# EAGLE schematic BrillBox (EAGLE 9.4.2)
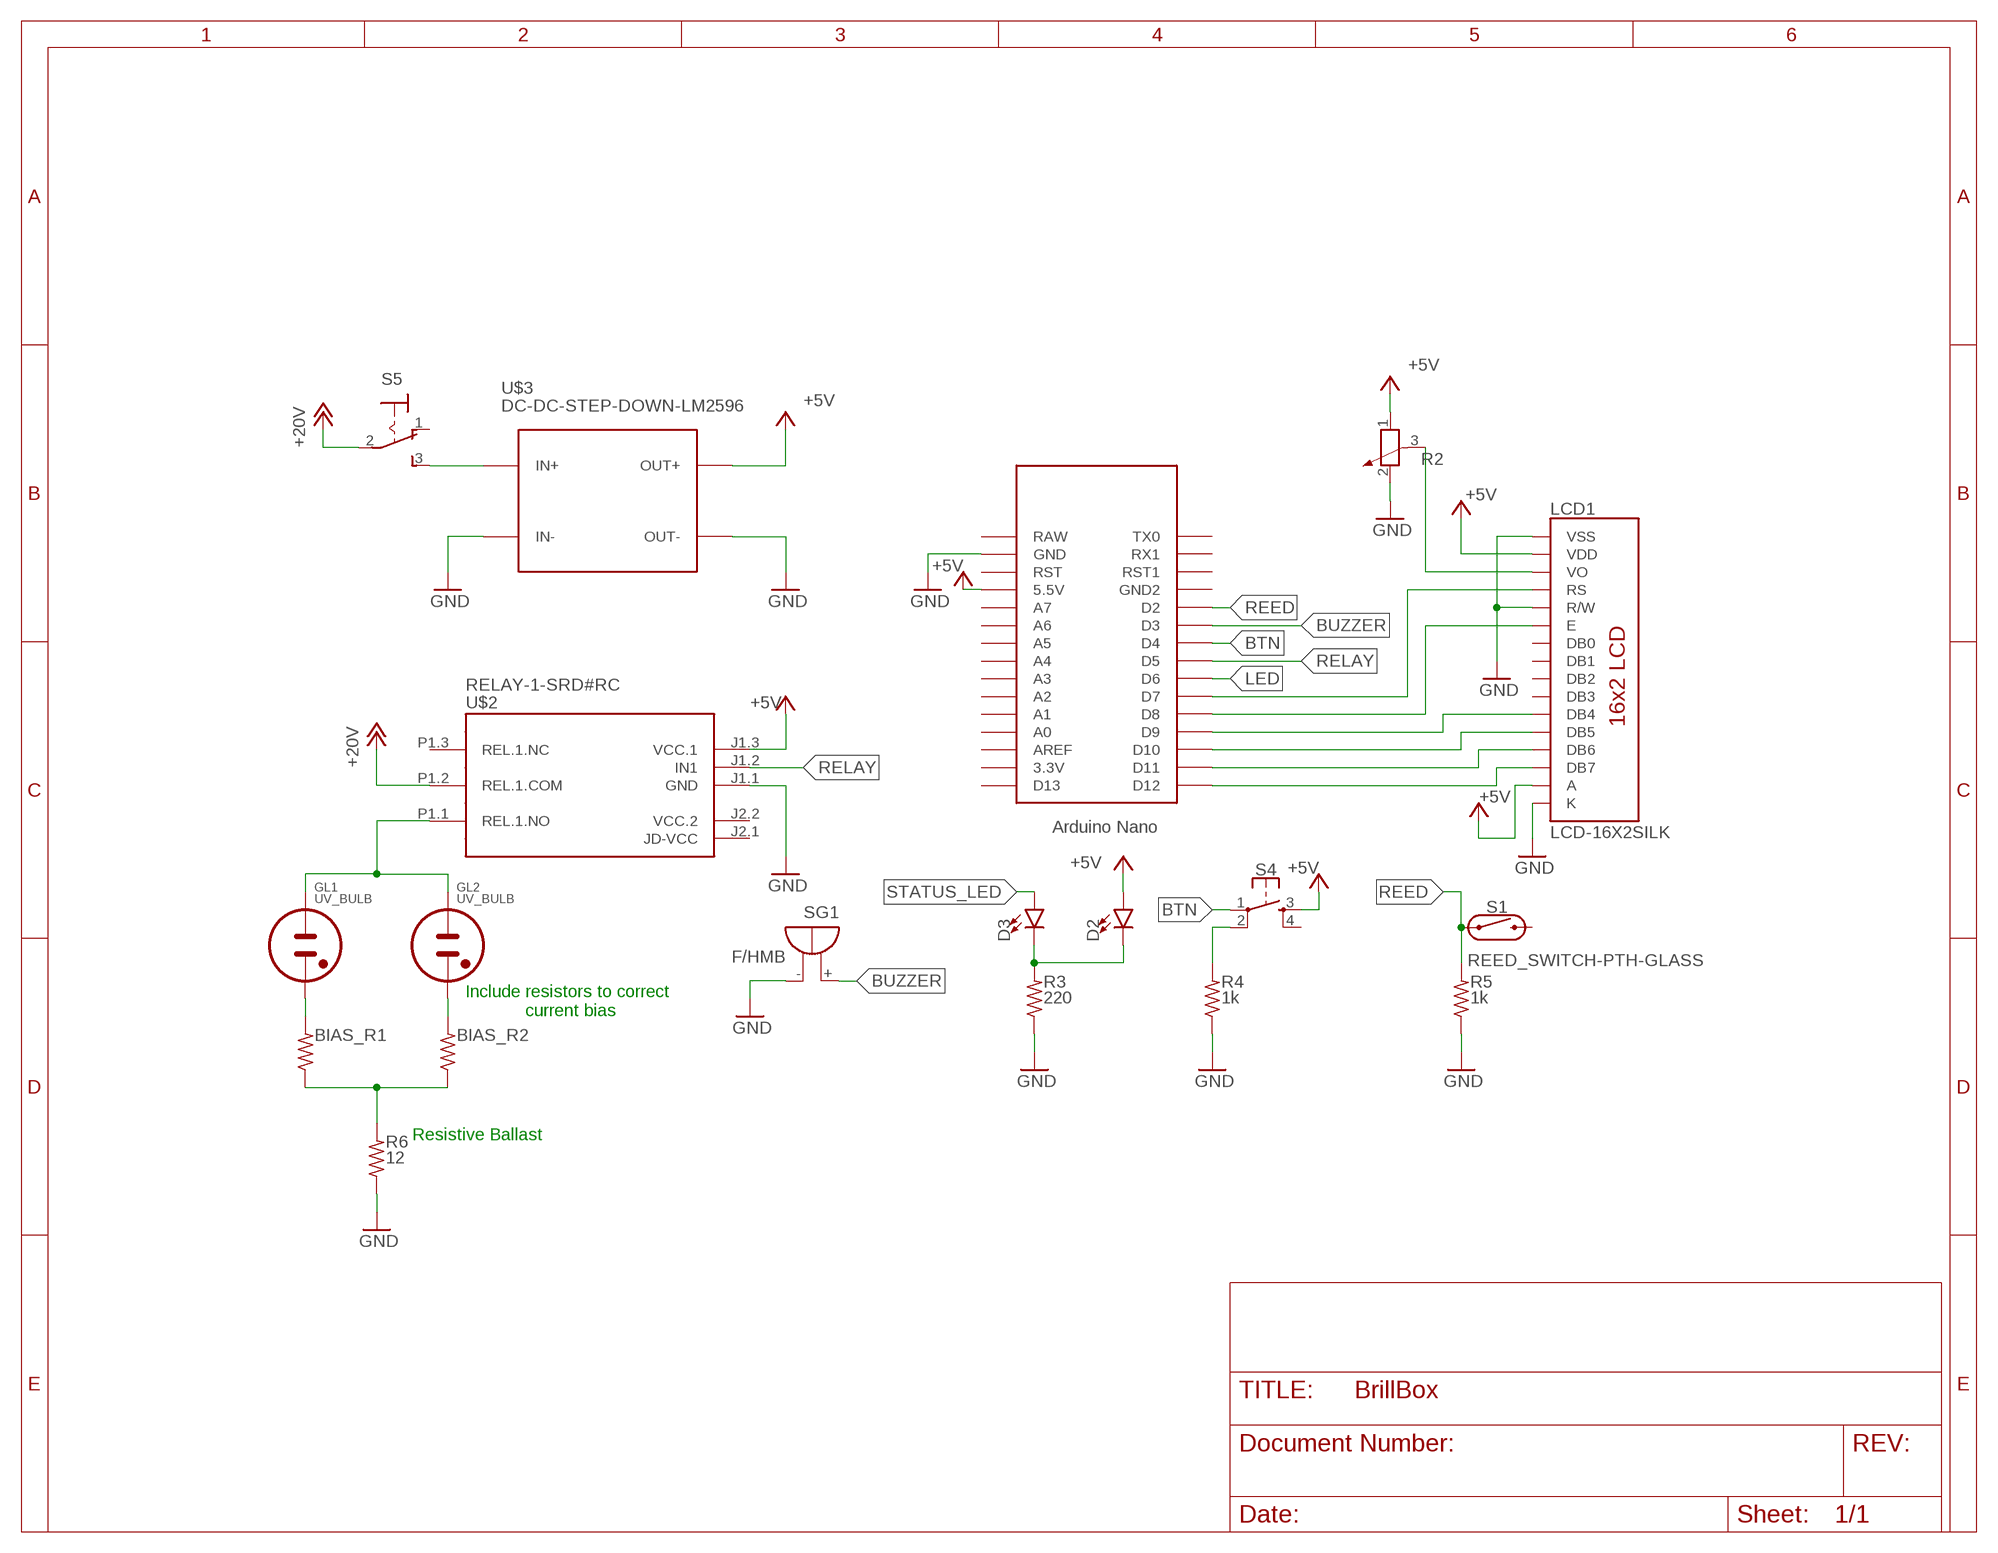
[diagram p0: schematic, sheet 1]

## Parts
BIAS_R1  R-US_0207/12  [0207/12]
BIAS_R2  R-US_0207/12  [0207/12]
D2  LED5MM  [LED_5MM]
D3  LED5MM  [LED_5MM]
GL1  UV_BULB  NE2-NEON-BULB-SMD  [NE2-NEON-BULB-SMD]
GL2  UV_BULB  NE2-NEON-BULB-SMD  [NE2-NEON-BULB-SMD]
LCD1  LCD-16X2SILK  [LCD-16X2]
R2  POTENTIOMETER_PT-10S  [PT-10S]
R3  220  R-US_0207/12  [0207/12]
R4  1k  R-US_0207/12  [0207/12]
R5  1k  R-US_0207/12  [0207/12]
R6  12  R-US_0207/12  [0207/12]
S1  REED_SWITCH-PTH-GLASS  [REED_SWITCH_GLASS]
S4  MOMENTARY-SWITCH-SPST-2-SMD-4.6X2.8MM  [TACTILE_SWITCH_SMD_4.6X2.8MM]
S5  M9040P  [M9040P]
SG1  F/HMB  [F/HMB]
U$1  NANO  [NANO]
U$2  RELAY-1-SRD#RC  [RELAY-1-SRD#RC]
U$3  DC-DC-STEP-DOWN-LM2596  [DC-DC-STEP-DOWN-LM2596]

## Nets
+5V: D2.A LCD1.2(VDD) LCD1.15(A) R2.1 S4.3 U$1.5V(5.5V) U$2.J1.3(VCC.1) U$3.OUT+
+12V: S5.2(P) U$2.P1.2(REL.1.COM) ; supply symbol labelled +20V
BTN: S4.1 U$1.D4
BUZZER: SG1.+ U$1.D3
GND: LCD1.1(VSS) LCD1.5(R/W) LCD1.16(K) R2.2 R3.1 R4.1 R5.1 R6.1 SG1.- U$1.GND U$2.J1.1(GND) U$3.IN- U$3.OUT-
LED: U$1.D6
N$1: LCD1.14(DB7) U$1.D12
N$2: LCD1.13(DB6) U$1.D11
N$3: LCD1.12(DB5) U$1.D10
N$4: LCD1.11(DB4) U$1.D9
N$5: LCD1.6(E) U$1.D8
N$6: LCD1.4(RS) U$1.D7
N$7: GL1.1(A) GL2.1(A) U$2.P1.1(REL.1.NO)
N$8: D2.K(C) D3.K(C) R3.2
N$9: S5.3(S) U$3.IN+
N$10: BIAS_R2.2 GL2.2(A1)
N$11: R4.2 S4.2
N$12: BIAS_R1.2 GL1.2(A1)
N$13: BIAS_R1.1 BIAS_R2.1 R6.2
N$14: LCD1.3(VO) R2.3
REED: R5.2 S1.P$1 U$1.D2
RELAY: U$1.D5 U$2.J1.2(IN1)
STATUS_LED: D3.A
Unconnected: LCD1.7(DB0) LCD1.8(DB1) LCD1.9(DB2) LCD1.10(DB3) S1.P$2 S4.4 S5.1(O) U$1.3.3V U$1.A0 U$1.A1 U$1.A2 U$1.A3 U$1.A4 U$1.A5 U$1.A6 U$1.A7 U$1.AREF U$1.D13 U$1.GND1(GND2) U$1.ICSP1 U$1.ICSP2 U$1.ICSP3 U$1.ICSP4 U$1.ICSP5 U$1.ICSP6 U$1.RAW U$1.RST U$1.RST1 U$1.RX1 U$1.TX0 U$2.J2.1(JD-VCC) U$2.P1.3(REL.1.NC)

## Notes on the sheet
- Include resistors to correct
              current bias
- Resistive Ballast

## Power pins joined to a net without a drawn wire
VCC.2: U$2.J2.2(VCC.2)

## Library data of the parts
BIAS_R1 BIAS_R2 R3-R6 = rcl:R-US_: RESISTOR, American symbol; SPICEPREFIX: R
D2 D3 = SparkFun-LED:LED: LED (Generic) Standard schematic elements and footprints for 5mm, 3mm, 1206, and 0603 sized LEDs. Generic LEDs with no color specified.
GL1 GL2 = nixie_tube:NE2-NEON-BULB: Neon indicator (wire connection)
LCD1 = SparkFun-Displays:LCD-16X2: Standard text-only 16x2 parallel input LCD Basic 16 character by 2 line display. Typically utilizes the extremely common HD44780 parallel interface chipset SparkFun Products: Basic 16x2 Green <https://www.sparkfun.com/products/255> Basic 8x2 Green <https://www.sparkfun.com/products/11122>; PROD_ID: LCD-12633; SF_ID: LCD-00255
R2 = rcl:POTENTIOMETER_: Potentiometer; SPICEMODEL: POT; SPICEPREFIX: X
S1 = SparkFun-Switches:REED_SWITCH: Reed Switch A reed switch is a magnetically-actuated switch. When the device is exposed to a magnetic field, the two ferrous materials inside the switch pull together and the switch closes. Variant Overview PTH-GLASS Reed Switch <https://www.sparkfun.com/products/8642> (COM-08642) - PTH reed switch w/ glass body (6.0 x 0.9 mm) PTH-INSULATED Reed Switch - Insulated <https://www.sparkfun.com/products/10601> (COM-10601) - PTH reed switch w/ insulated body (15.1 x 4.2 mm); PROD_ID: SWCH-09282; SF_SKU: COM-08642
S4 = SparkFun-Switches:MOMENTARY-SWITCH-SPST-2: Momentary Switch (Pushbutton) - SPST - Two Circuits Normally-open (NO) SPST momentary switches (buttons, pushbuttons). Schematic symbol includes two switch circuits. Variants SMD-4.6MMX2.8MM - 4.60mm x 2.80mm Tactile Momentary Button Switch - Used on SparkFun SAMD21 Mini Breakout <https://www.sparkfun.com/products/13664> SMD-5.2MM - Mini Pushbutton Switch - SMD <https://www.sparkfun.com/products/8720> - Used on Arduino Pro Mini <https://www.sparkfun.com/products/11114>; PROD_ID: SWCH-13065
S5 = switch:M9040P: TOGGLE SWITCH Marquardt
SG1 = buzzer:F/HMB: BUZZER Source: Buerklin; OC_FARNELL: unknown; OC_NEWARK: unknown
U$1 = Arduino-clone:NANO: Arduino Nano
U$2 = diy-modules:RELAY-1-SRD#RC: 1-Channel Relay Module based on SRD-05VDC-SL-C relays Symbol with relays pins Click here to find device on ebay.com <http://www.ebay.com/sch/one+channel+isolated+relay+5v>
U$3 = diy-modules:DC-DC-STEP-DOWN-LM2596: DC/DC Step-Down Regulator based on LM2596-ADJ chip LM2596 datasheet available here: http://www.ti.com/lit/ds/symlink/lm2596.pdf Click here to find device on ebay.com <http://www.ebay.com/sch/lm2596+power+regulator>